# Altium project GameBoard_V1I1.PrjPcb (part 10 of 20)

## Sheet [27] - LEDS, BUTTONS.SchDoc
size A2; DocumentNumber: 26; SheetNumber: 26; SheetTotal: 32
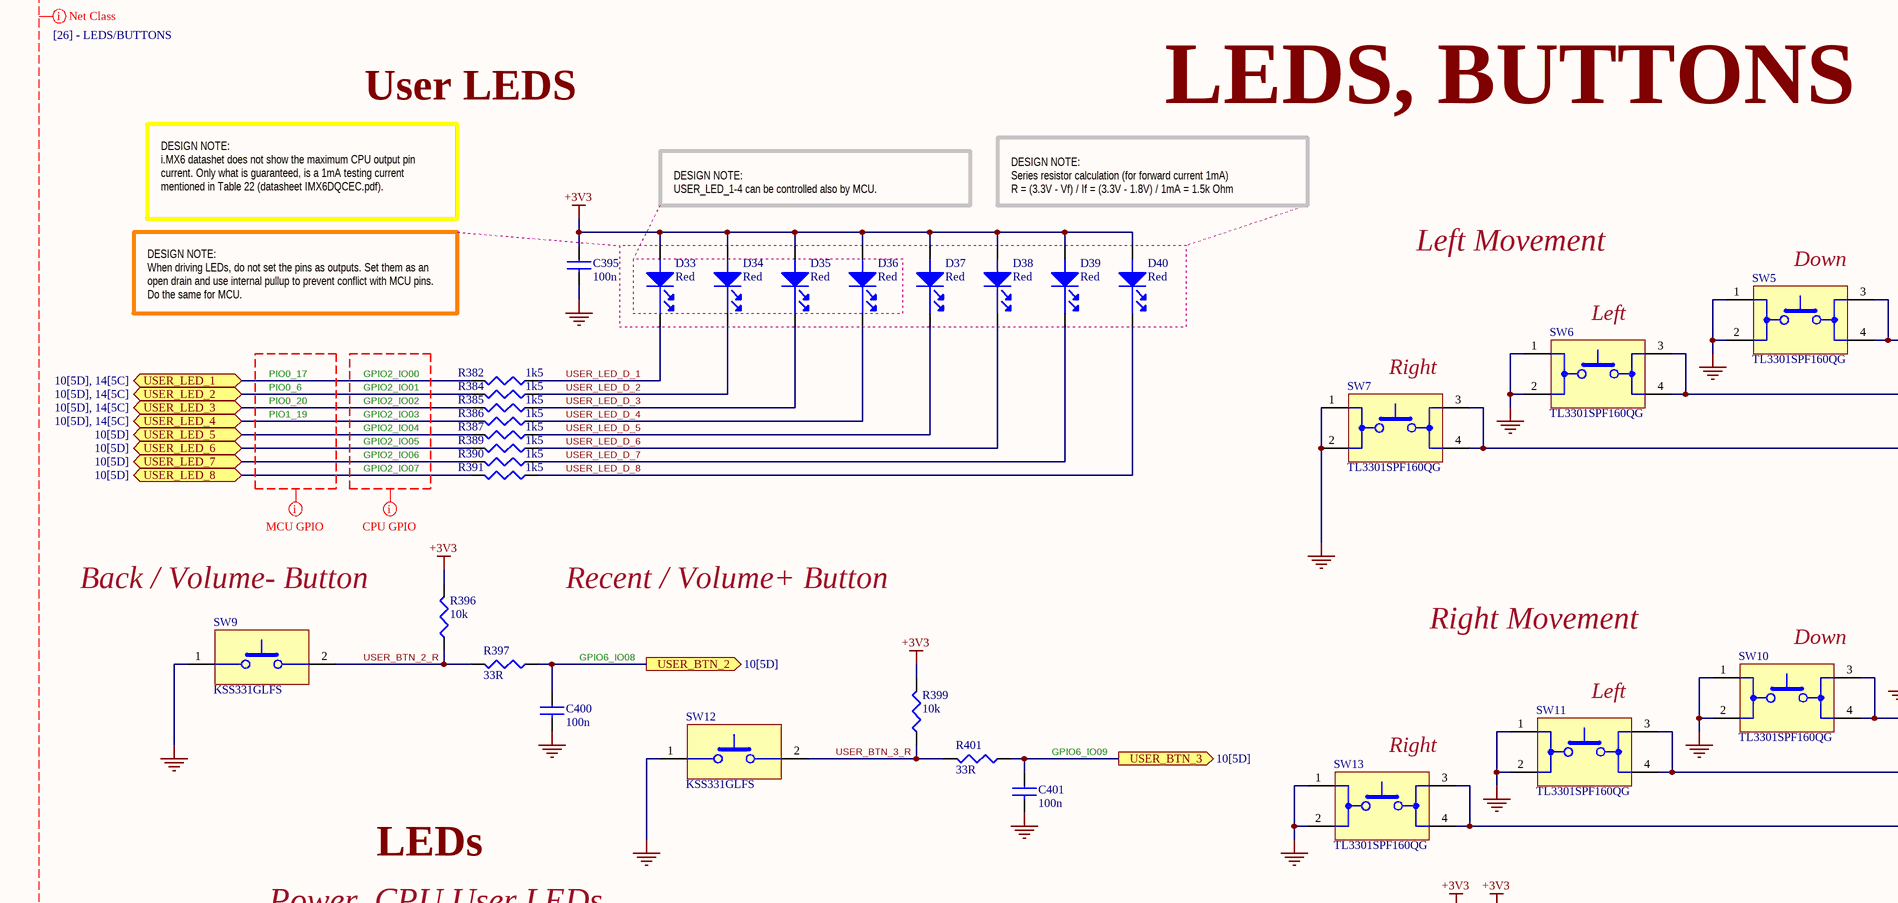
[diagram p58: [27] - LEDS, BUTTONS.SchDoc, top left]
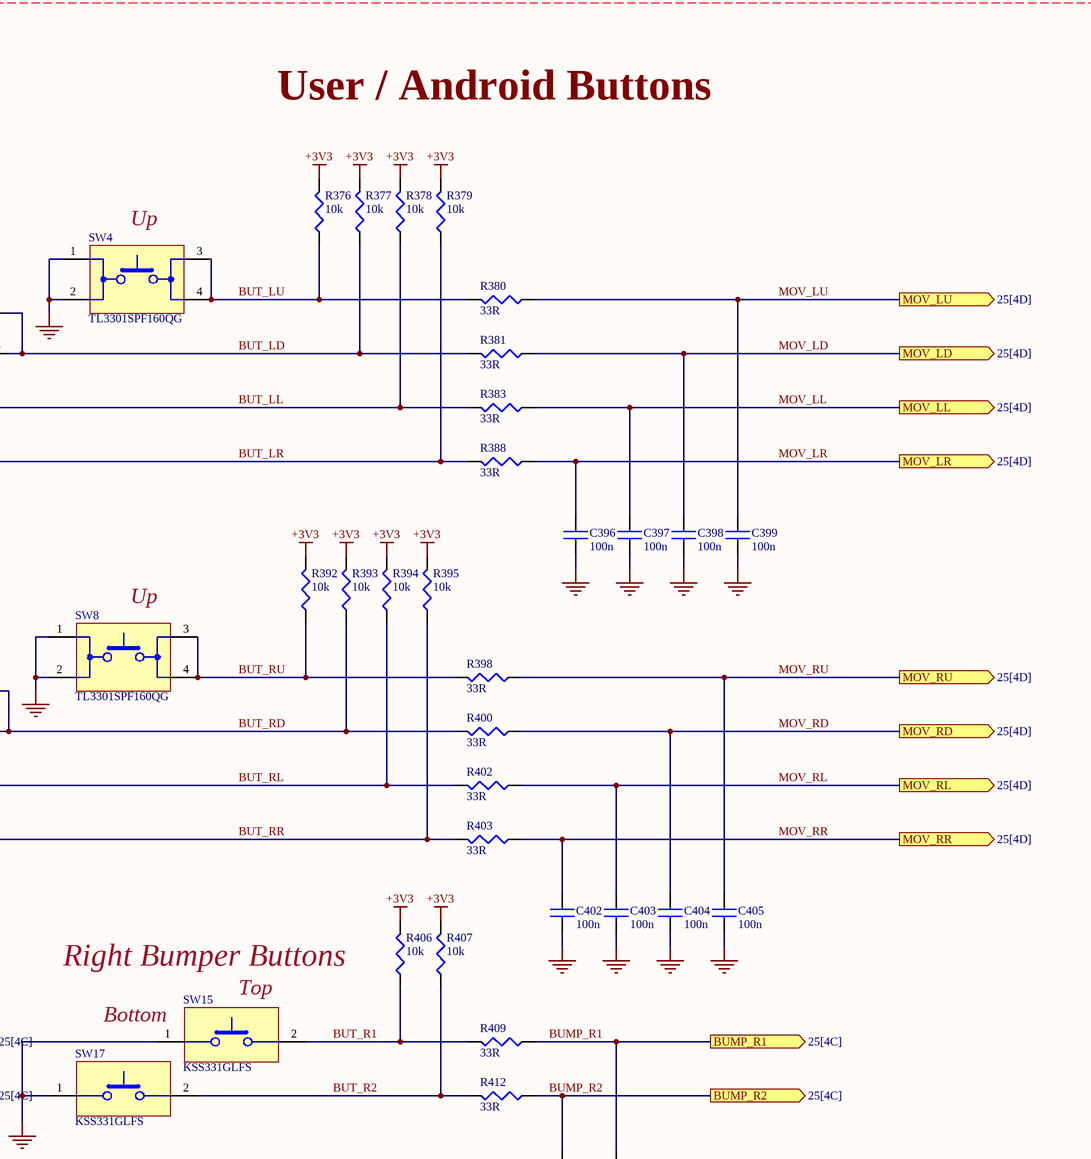
[diagram p59: [27] - LEDS, BUTTONS.SchDoc, top right]
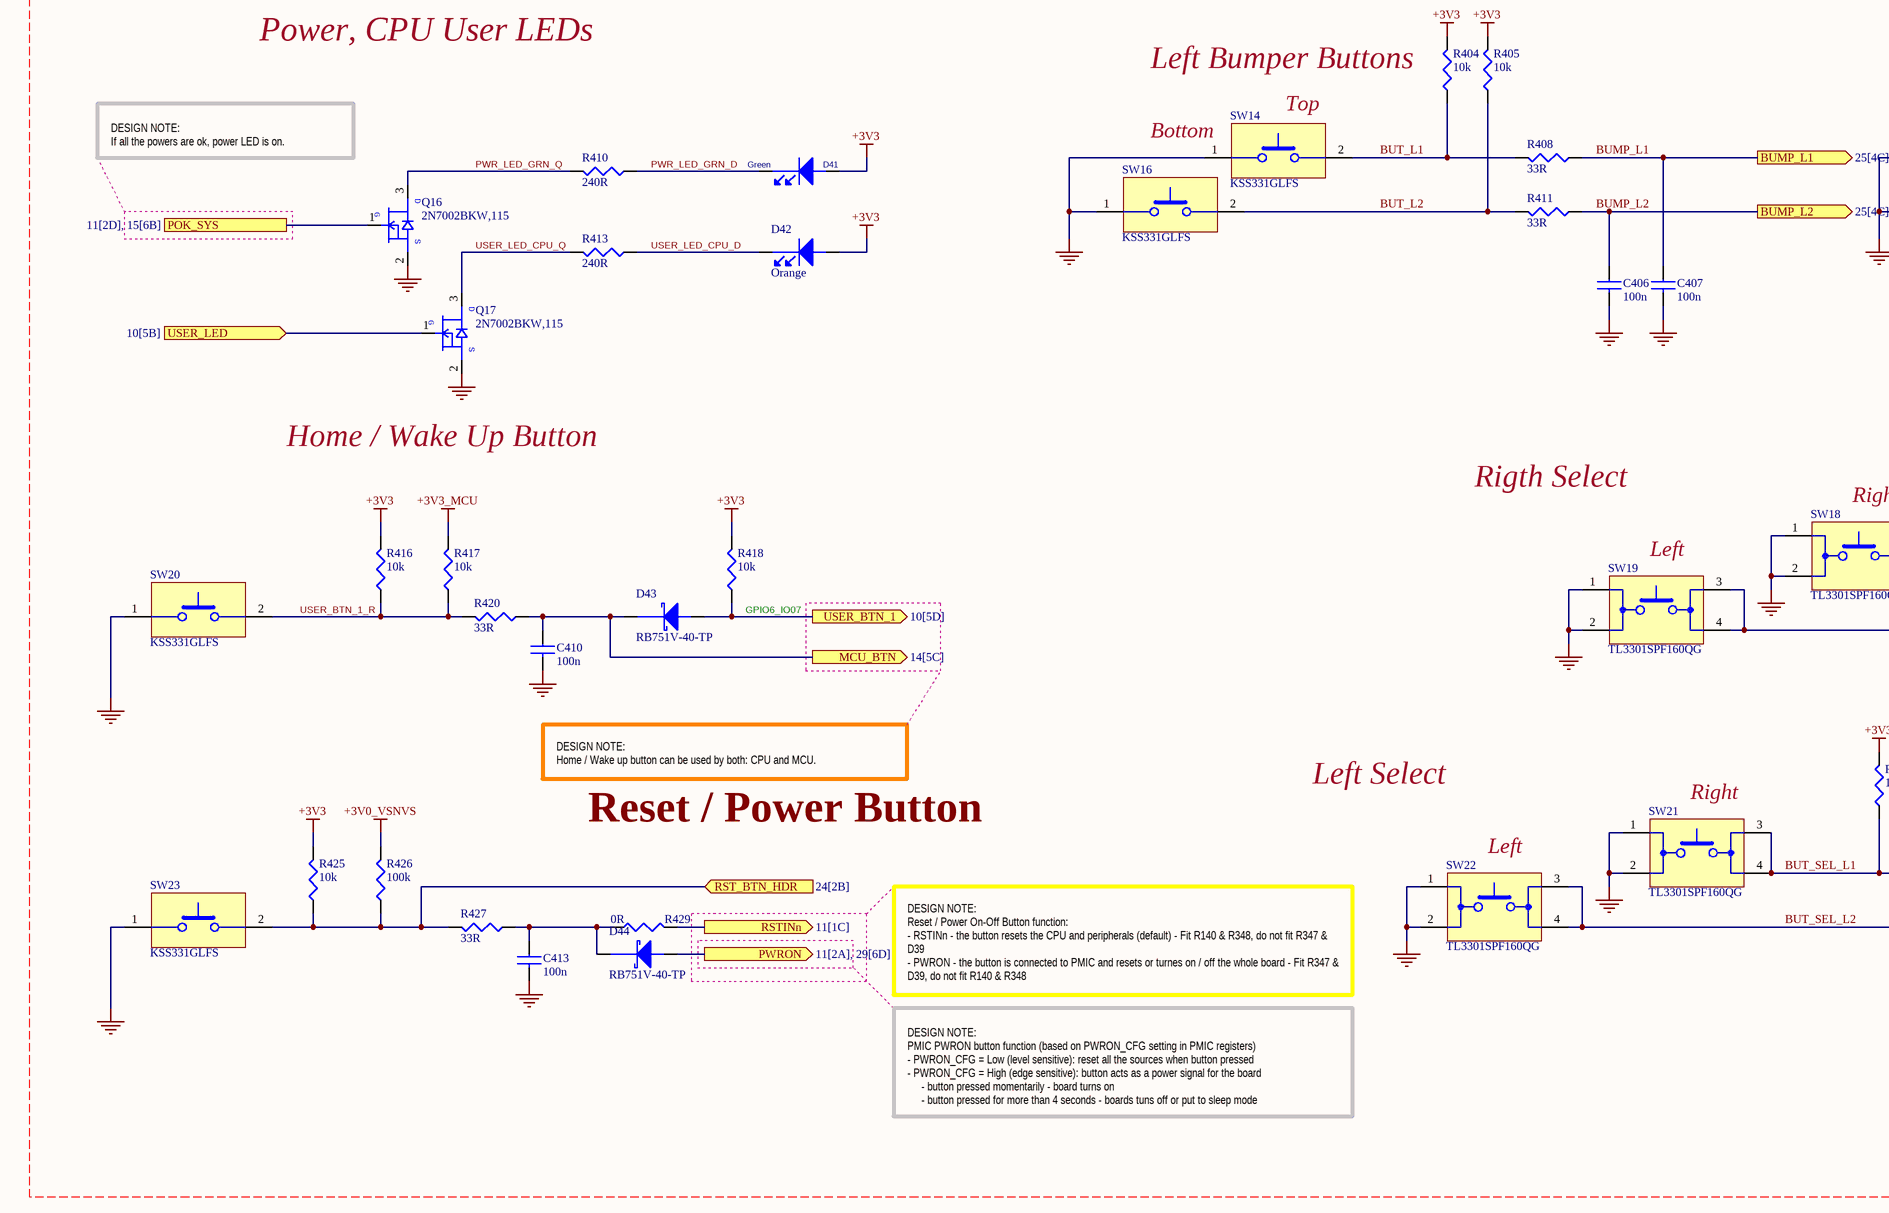
[diagram p60: [27] - LEDS, BUTTONS.SchDoc, bottom left]
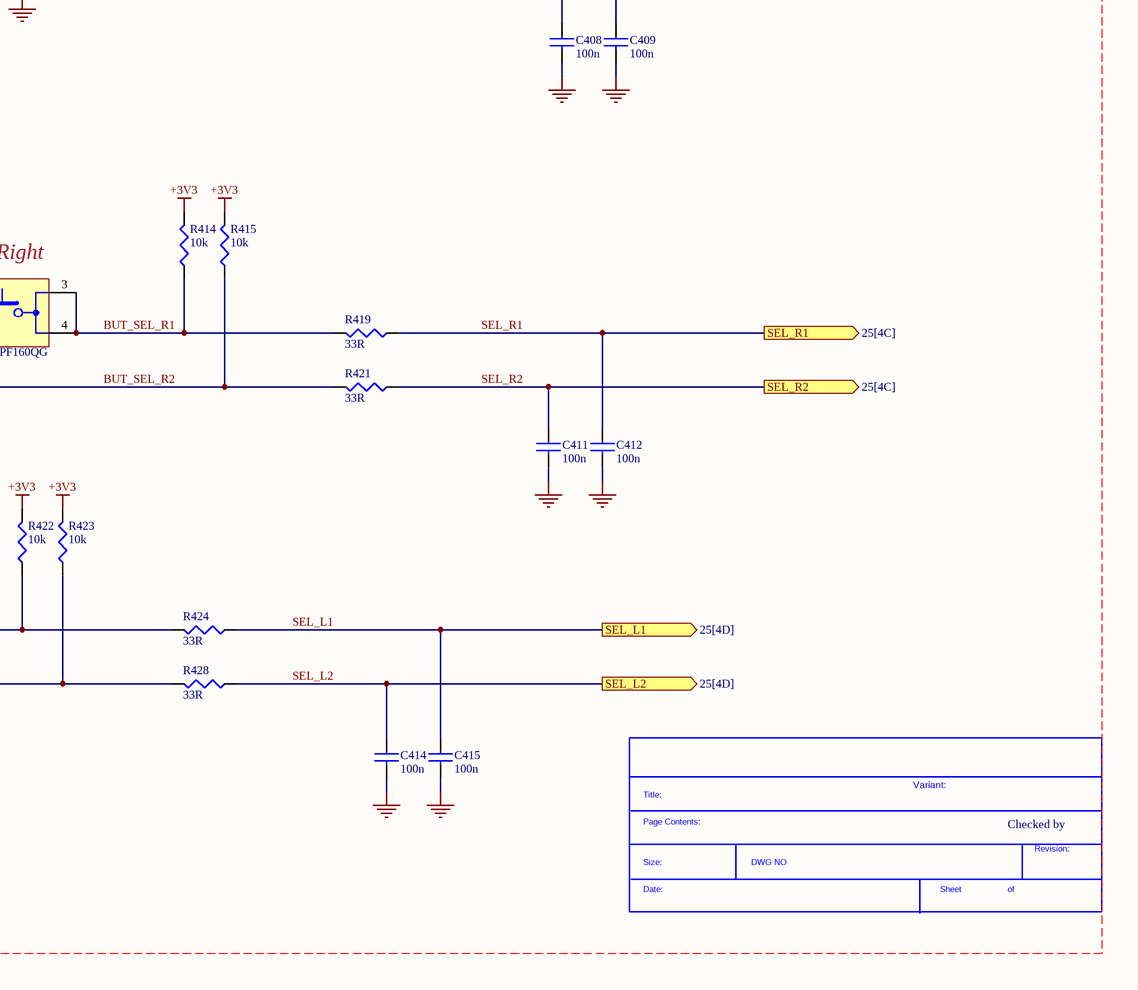
[diagram p61: [27] - LEDS, BUTTONS.SchDoc, bottom right]

### Parts
(Parts that share a designator on the sheet are numbered #1, #2 ... from top to bottom, then left to right.)
*#20  SDTitleBlock  (value not drawn)  (graphical)
C395  100n  [C0402]
C396  100n  [C0402]
C397  100n  [C0402]
C398  100n  [C0402]
C399  100n  [C0402]
C400  100n  [C0402]
C401  100n  [C0402]
C402  100n  [C0402]
C403  100n  [C0402]
C404  100n  [C0402]
C405  100n  [C0402]
C406  100n  [C0402]
C407  100n  [C0402]
C408  100n  [C0402]
C409  100n  [C0402]
C410  100n  [C0402]
C411  100n  [C0402]
C412  100n  [C0402]
C413  100n  [C0402]
C414  100n  [C0402]
C415  100n  [C0402]
D33  Red  [LED_0603]
D34  Red  [LED_0603]
D35  Red  [LED_0603]
D36  Red  [LED_0603]
D37  Red  [LED_0603]
D38  Red  [LED_0603]
D39  Red  [LED_0603]
D40  Red  [LED_0603]
D41  Green  [LED_0603]
D42  Orange  [LED_0603]
D43  RB751V-40-TP  [SOD323]
D44  RB751V-40-TP  [SOD323]
Q16  2N7002BKW,115  [SC70_SOT323]
Q17  2N7002BKW,115  [SC70_SOT323]
R376  10k  [R0402]
R377  10k  [R0402]
R378  10k  [R0402]
R379  10k  [R0402]
R380  33R  [R0402]
R381  33R  [R0402]
R382  1k5  [R0402]
R383  33R  [R0402]
R384  1k5  [R0402]
R385  1k5  [R0402]
R386  1k5  [R0402]
R387  1k5  [R0402]
R388  33R  [R0402]
R389  1k5  [R0402]
R390  1k5  [R0402]
R391  1k5  [R0402]
R392  10k  [R0402]
R393  10k  [R0402]
R394  10k  [R0402]
R395  10k  [R0402]
R396  10k  [R0402]
R397  33R  [R0402]
R398  33R  [R0402]
R399  10k  [R0402]
R400  33R  [R0402]
R401  33R  [R0402]
R402  33R  [R0402]
R403  33R  [R0402]
R404  10k  [R0402]
R405  10k  [R0402]
R406  10k  [R0402]
R407  10k  [R0402]
R408  33R  [R0402]
R409  33R  [R0402]
R410  240R  [R0402]
R411  33R  [R0402]
R412  33R  [R0402]
R413  240R  [R0402]
R414  10k  [R0402]
R415  10k  [R0402]
R416  10k  [R0402]
R417  10k  [R0402]
R418  10k  [R0402]
R419  33R  [R0402]
R420  33R  [R0402]
R421  33R  [R0402]
R422  10k  [R0402]
R423  10k  [R0402]
R424  33R  [R0402]
R425  10k  [R0402]
R426  100k  [R0402]
R427  33R  [R0402]
R428  33R  [R0402]
R429  0R  [R0402]
SW4  TL3301SPF160QG  [TACT_SMD_PLUNGER]
SW5  TL3301SPF160QG  [TACT_SMD_PLUNGER]
SW6  TL3301SPF160QG  [TACT_SMD_PLUNGER]
SW7  TL3301SPF160QG  [TACT_SMD_PLUNGER]
SW8  TL3301SPF160QG  [TACT_SMD_PLUNGER]
SW9  KSS331GLFS  [TACT_SMD_RA]
SW10  TL3301SPF160QG  [TACT_SMD_PLUNGER]
SW11  TL3301SPF160QG  [TACT_SMD_PLUNGER]
SW12  KSS331GLFS  [TACT_SMD_RA]
SW13  TL3301SPF160QG  [TACT_SMD_PLUNGER]
SW14  KSS331GLFS  [TACT_SMD_RA]
SW15  KSS331GLFS  [TACT_SMD_RA]
SW16  KSS331GLFS  [TACT_SMD_RA]
SW17  KSS331GLFS  [TACT_SMD_RA]
SW18  TL3301SPF160QG  [TACT_SMD_PLUNGER]
SW19  TL3301SPF160QG  [TACT_SMD_PLUNGER]
SW20  KSS331GLFS  [TACT_SMD_RA]
SW21  TL3301SPF160QG  [TACT_SMD_PLUNGER]
SW22  TL3301SPF160QG  [TACT_SMD_PLUNGER]
SW23  KSS331GLFS  [TACT_SMD_RA]

### Ports
BUMP_L1 (out, see 25[4C]), BUMP_L2 (out, see 25[4C]), BUMP_R1 (out, see 25[4C]), BUMP_R2 (out, see 25[4C]), MCU_BTN (out, see 14[5C]), MOV_LD (out, see 25[4D]), MOV_LL (out, see 25[4D]), MOV_LR (out, see 25[4D]), MOV_LU (out, see 25[4D]), MOV_RD (out, see 25[4D]), MOV_RL (out, see 25[4D]), MOV_RR (out, see 25[4D]), MOV_RU (out, see 25[4D]), POK_SYS (see 11[2D], 15[6B]), PWRON (out, see 11[2A], 29[6D]), RST_BTN_HDR (in, see 24[2B]), RSTINn (out, see 11[1C]), SEL_L1 (out, see 25[4D]), SEL_L2 (out, see 25[4D]), SEL_R1 (out, see 25[4C]), SEL_R2 (out, see 25[4C]), USER_BTN_1 (out, see 10[5D]), USER_BTN_2 (out, see 10[5D]), USER_BTN_3 (out, see 10[5D]), USER_LED (in, see 10[5B]), USER_LED_1 (bidir, see 10[5D], 14[5C]), USER_LED_2 (bidir, see 10[5D], 14[5C]), USER_LED_3 (bidir, see 10[5D], 14[5C]), USER_LED_4 (bidir, see 10[5D], 14[5C]), USER_LED_5 (bidir, see 10[5D]), USER_LED_6 (bidir, see 10[5D]), USER_LED_7 (bidir, see 10[5D]), USER_LED_8 (bidir, see 10[5D])

### Nets
+3V0_VSNVS: R426.2
+3V3: C395.1 D33.2(ANODE) D34.2(ANODE) D35.2(ANODE) D36.2(ANODE) D37.2(ANODE) D38.2(ANODE) D39.2(ANODE) D40.2(ANODE) D41.2(ANODE) D42.2(ANODE) R376.2 R377.2 R378.2 R379.2 R392.2 R393.2 R394.2 R395.2 R396.2 R399.2 R404.2 R405.2 R406.2 R407.2 R414.2 R415.2 R416.2 R418.2 R422.2 R423.2 R425.2
+3V3_MCU: R417.2
GND: C395.2 C396.2 C397.2 C398.2 C399.2 C400.2 C401.2 C402.2 C403.2 C404.2 C405.2 C406.2 C407.2 C408.2 C409.2 C410.2 C411.2 C412.2 C413.2 C414.2 C415.2 Q16.2(SOURCE) Q17.2(SOURCE) SW4.1 SW4.2 SW5.1 SW5.2 SW6.1 SW6.2 SW7.1 SW7.2 SW8.1 SW8.2 SW9.1 SW10.1 SW10.2 SW11.1 SW11.2 SW12.1 SW13.1 SW13.2 SW14.1 SW15.1 SW16.1 SW17.1 SW18.1 SW18.2 SW19.1 SW19.2 SW20.1 SW21.1 SW21.2 SW22.1 SW22.2 SW23.1
BUMP_L1: C407.1 R408.1 ; port BUMP_L1
BUMP_L2: C406.1 R411.1 ; port BUMP_L2
BUMP_R1: C409.1 R409.1 ; port BUMP_R1
BUMP_R2: C408.1 R412.1 ; port BUMP_R2
BUT_L1: R404.1 R408.2 SW14.2
BUT_L2: R405.1 R411.2 SW16.2
BUT_LD: R377.1 R381.2 SW5.3(MECH1) SW5.4(MECH2)
BUT_LL: R378.1 R383.2 SW6.3(MECH1) SW6.4(MECH2)
BUT_LR: R379.1 R388.2 SW7.3(MECH1) SW7.4(MECH2)
BUT_LU: R376.1 R380.2 SW4.3(MECH1) SW4.4(MECH2)
BUT_R1: R406.1 R409.2 SW15.2
BUT_R2: R407.1 R412.2 SW17.2
BUT_RD: R393.1 R400.2 SW10.3(MECH1) SW10.4(MECH2)
BUT_RL: R394.1 R402.2 SW11.3(MECH1) SW11.4(MECH2)
BUT_RR: R395.1 R403.2 SW13.3(MECH1) SW13.4(MECH2)
BUT_RU: R392.1 R398.2 SW8.3(MECH1) SW8.4(MECH2)
BUT_SEL_L1: R422.1 R424.2 SW21.3(MECH1) SW21.4(MECH2)
BUT_SEL_L2: R423.1 R428.2 SW22.3(MECH1) SW22.4(MECH2)
BUT_SEL_R1: R414.1 R419.2 SW18.3(MECH1) SW18.4(MECH2)
BUT_SEL_R2: R415.1 R421.2 SW19.3(MECH1) SW19.4(MECH2)
MCU_BTN: C410.1 D43.1(cathode) R420.1 ; port MCU_BTN
MOV_LD: C398.1 R381.1 ; port MOV_LD
MOV_LL: C397.1 R383.1 ; port MOV_LL
MOV_LR: C396.1 R388.1 ; port MOV_LR
MOV_LU: C399.1 R380.1 ; port MOV_LU
MOV_RD: C404.1 R400.1 ; port MOV_RD
MOV_RL: C403.1 R402.1 ; port MOV_RL
MOV_RR: C402.1 R403.1 ; port MOV_RR
MOV_RU: C405.1 R398.1 ; port MOV_RU
POK_SYS: Q16.1(GATE) ; port POK_SYS
PWR_LED_GRN_D: D41.1(cathode) R410.1
PWR_LED_GRN_Q: Q16.3(DRAIN) R410.2
PWRON: D44.2(ANODE) ; port PWRON
RST_BTN_HDR: R425.1 R426.1 R427.2 SW23.2 ; port RST_BTN_HDR
RSTINn: R429.2 ; port RSTINn
SEL_L1: C415.1 R424.1 ; port SEL_L1
SEL_L2: C414.1 R428.1 ; port SEL_L2
SEL_R1: C412.1 R419.1 ; port SEL_R1
SEL_R2: C411.1 R421.1 ; port SEL_R2
USER_BTN_1: D43.2(ANODE) R418.1 ; port USER_BTN_1
USER_BTN_1_R: R416.1 R417.1 R420.2 SW20.2
USER_BTN_2: C400.1 R397.1 ; port USER_BTN_2
USER_BTN_2_R: R396.1 R397.2 SW9.2
USER_BTN_3: C401.1 R401.1 ; port USER_BTN_3
USER_BTN_3_R: R399.1 R401.2 SW12.2
USER_LED: Q17.1(GATE) ; port USER_LED
USER_LED_1: R382.2 ; port USER_LED_1
USER_LED_2: R384.2 ; port USER_LED_2
USER_LED_3: R385.2 ; port USER_LED_3
USER_LED_4: R386.2 ; port USER_LED_4
USER_LED_5: R387.2 ; port USER_LED_5
USER_LED_6: R389.2 ; port USER_LED_6
USER_LED_7: R390.2 ; port USER_LED_7
USER_LED_8: R391.2 ; port USER_LED_8
USER_LED_CPU_D: D42.1(cathode) R413.1
USER_LED_CPU_Q: Q17.3(DRAIN) R413.2
USER_LED_D_1: D33.1(cathode) R382.1
USER_LED_D_2: D34.1(cathode) R384.1
USER_LED_D_3: D35.1(cathode) R385.1
USER_LED_D_4: D36.1(cathode) R386.1
USER_LED_D_5: D37.1(cathode) R387.1
USER_LED_D_6: D38.1(cathode) R389.1
USER_LED_D_7: D39.1(cathode) R390.1
USER_LED_D_8: D40.1(cathode) R391.1
NetC413_1: C413.1 D44.1(cathode) R427.1 R429.1

### Layout directives
mark named CPU GPIO: (no net found under the mark)
mark named MCU GPIO: (no net found under the mark)
net class [26] - LEDS/BUTTONS: +3V0_VSNVS, +3V3, +3V3_MCU, BUMP_L1, BUMP_L2, BUMP_R1, BUMP_R2, BUT_L1, BUT_L2, BUT_LD, BUT_LL, BUT_LR, BUT_LU, BUT_R1, BUT_R2, BUT_RD, BUT_RL, BUT_RR, BUT_RU, BUT_SEL_L1, BUT_SEL_L2, BUT_SEL_R1, BUT_SEL_R2, GND, MOV_LD, MOV_LL, MOV_LR, MOV_LU, MOV_RD, MOV_RL, MOV_RR, MOV_RU, PWR_LED_GRN_D, PWR_LED_GRN_Q, SEL_L1, SEL_L2, SEL_R1, SEL_R2, USER_BTN_1_R, USER_BTN_2_R, USER_BTN_3_R, USER_LED_CPU_D, USER_LED_CPU_Q, USER_LED_D_1, USER_LED_D_2, USER_LED_D_3, USER_LED_D_4, USER_LED_D_5, USER_LED_D_6, USER_LED_D_7, USER_LED_D_8

### Notes on the sheet
- User LEDS
- LEDS, BUTTONS
- User / Android Buttons
- DESIGN NOTE:
  i.MX6 datashet does not show the maximum CPU output pin current. Only what is guaranteed, is a 1mA testing current mentioned in Table 22 (datasheet IMX6DQCEC.pdf).
- DESIGN NOTE:
  USER_LED_1-4 can be controlled also by MCU.
- DESIGN NOTE:
  Series resistor calculation (for forward current 1mA)
  R = (3.3V - Vf) / If = (3.3V - 1.8V) / 1mA = 1.5k Ohm
- Left Movement
- (near SW5) Down
- (near SW4) Up
- DESIGN NOTE:
  When driving LEDs, do not set the pins as outputs. Set them as an open drain and use internal pullup to prevent conflict with MCU pins. Do the same for MCU.
- (near SW6) Left
- PIO0_6
- PIO0_20
- PIO0_17
- GPIO2_IO00
- GPIO2_IO01
- GPIO2_IO02
- (near SW7) Right
- PIO1_19
- GPIO2_IO03
- GPIO2_IO04
- GPIO2_IO05
- GPIO2_IO06
- GPIO2_IO07
- (near R396) Back / Volume- Button
- Recent / Volume+ Button
- (near SW8) Up
- GPIO6_IO08
- Right Movement
- (near SW10) Down
- (near SW11) Left
- GPIO6_IO09
- (near SW13) Right
- LEDs
- Power, CPU User LEDs
- (near R404) Left Bumper Buttons
- (near SW14) Bottom
- (near SW14) Top
- (near R406) Right Bumper Buttons
- (near SW15) Bottom
- (near SW15) Top
- DESIGN NOTE:
  If all the powers are ok, power LED is on.
- Home / Wake Up Button
- Rigth Select
- (near SW18) Right
- (near R418) GPIO6_IO07
- (near SW19) Left
- DESIGN NOTE:
  Home / Wake up button can be used by both: CPU and MCU.
- Left Select
- (near SW21) Right
- Reset / Power Button
- (near SW22) Left
- DESIGN NOTE:
  Reset / Power On-Off Button function:
  - RSTINn - the button resets the CPU and peripherals (default) - Fit R140 & R348, do not fit R347 & D39
  - PWRON - the button is connected to PMIC and resets or turnes on / off the whole board - Fit R347 & D39, do not fit R140 & R348
- Variant:
- Checked by
- DESIGN NOTE:
  PMIC PWRON button function (based on PWRON_CFG setting in PMIC registers)
  - PWRON_CFG = Low (level sensitive): reset all the sources when button pressed
  - PWRON_CFG = High (edge sensitive): button acts as a power signal for the board
  - button pressed momentarily - board turns on
  - button pressed for more than 4 seconds - boards tuns off or put to sleep mode
- (in symbol 2N7002BKW,115) D; G; S
- (in symbol SDTitleBlock) Title:; Page Contents:; Revision:; Size:; DWG NO; Date:; Sheet; of

### Library data of the parts
C395-C415 = C1005X5R1H104K: as C241 on sheet [19] - USB; Category: Capacitors; Supplier Part Number: 445-5942-1-ND; Manufacturer Part Number: C1005X5R1H104K; Operating Temperature: -55°C ~ 85°C; Package / Case: 0402 (1005 Metric); Price 1k [$]: 0.02340; .Checked SCH: used; Voltage - Rated: 50V; Supplier: Digikey; Supplier 1: Digi-Key; Supplier Part Number 1: 445-5942-1-ND; RoHS: RoHS Compliant; Stock 1: 106926; Pricing 1: 1=0.27, 10=0.18, 100=0.072, 250=0.05176, 500=0.0369, 1000=0.027 (USD); Tolerance: ±10%; Temperature Coefficient: X5R; Mounting Type: Surface Mount, MLCC; Applications: General Purpose; Ratings: -; Size / Dimension: 0.039" L x 0.020" W (1.00mm x 0.50mm); Height - Seated (Max): -; Thickness (Max): 0.022" (0.55mm); Lead Spacing: -; Features: -; Packaging: Cut Tape (CT); Lead Style: -; ComponentLink1URL: http://www.tdk.co.jp/tefe02/e412_c.pdf; ComponentLink1Description: http://www.tdk.co.jp/tefe02/e412_c.pdf; Supplier 2: Digi-Key; Supplier Part Number 2: 311-1697-6-ND
D33-D40 = LS L29K-H1J2-1-Z: LED SMARTLED RED 630NM 0603 SMD; Manufacturer: OSRAM Opto Semiconductors Inc; Millicandela Rating: 4.95mcd; Voltage - Forward (Vf) Typ: 1.8V; Current - Test: 2mA; Wavelength - Peak: 643nm; Viewing Angle: 160°; Lens Type: Diffused; Lens Style/Size: Rectangle with Flat Top, 1.3mm x 0.8mm; Luminous Flux @ Current - Test: 20 mlm; .Checked PCB: used; Supplier 1: Digi-Key; Supplier Part Number 1: 475-1195-1-ND; Manufacturer Part Number: LS L29K-H1J2-1-Z; RoHS: RoHS Compliant; Category: Optoelectronics; Stock 1: 71670; Pricing 1: 1=0.16, 10=0.137, 100=0.1093, 250=0.09564, 500=0.08744 (USD); Color: Red; Wavelength - Dominant: 630nm; Package / Case: 0603 (1608 Metric); Size / Dimension: 1.70mm L x 0.80mm W; Height: 0.65mm; Mounting Type: Surface Mount; Packaging: Cut Tape (CT); ComponentLink1URL: http://catalog.osram-os.com/catalogue/catalogue.do;jsessionid=DB7CFDBAC5AF1E216E45F622E867085A?act=downloadFile&favOid=020000010003f9de000100b6; ComponentLink1Description: http://catalog.osram-os.com/catalogue/catalogue.do;jsessionid=DB7CFDBAC5AF1E216E45F622E867085A?act=downloadFile&favOid=020000010003f9de000100b6; .Checked SCH: used
D41 = LG L29K-G2J1-24-Z: LED SMARTLED GREEN 570NM 0603; Manufacturer: OSRAM Opto Semiconductors Inc; .Checked PCB: used; Current - Test: 2mA; Voltage - Forward (Vf) Typ: 1.7V; Luminous Flux @ Current - Test: 12 mlm; Millicandela Rating: 3.92mcd; Wavelength - Peak: 572nm; Lens Type: Diffused; Lens Style/Size: Rectangle with Flat Top, 1.3mm x 0.8mm; Viewing Angle: 160°; Regulator Topology: Positive Fixed; Voltage - Output: 2.5V; Voltage - Input: 2.6 V ~ 6 V; Voltage - Dropout (Typical): 0.16V @ 500mA; Number of Regulators: 1; Current - Output: 500mA; Current - Limit (Min): 600mA; .Checked SCH: used; Category: Optoelectronics; Family: LEDs - <75mA, Discre; Manufacturer Part Number: LG L29K-G2J1-24-Z; Price 1k [$]: 0.08744; Value: Green; Color: Green; Package / Case: 0603 (1608 Metric); Supplier Part Number: 475-2709-1-ND; Supplier: Digikey; Supplier 1: Digi-Key; Supplier Part Number 1: 475-2709-1-ND; RoHS: RoHS Compliant; Stock 1: 30318; Pricing 1: 1=0.16, 10=0.137, 100=0.1093, 250=0.09564, 500=0.08744 (USD); Wavelength - Dominant: 570nm; Size / Dimension: 1.70mm L x 0.80mm W; Height: 0.65mm; Mounting Type: Surface Mount; Packaging: Cut Tape (CT); ComponentLink1URL: http://catalog.osram-os.com/catalogue/catalogue.do;jsessionid=32CB61882C089EDD4B6D0A54E7E1F117?act=downloadFile&favOid=020000020000138e000100b6; ComponentLink1Description: http://catalog.osram-os.com/catalogue/catalogue.do;jsessionid=32CB61882C089EDD4B6D0A54E7E1F117?act=downloadFile&favOid=020000020000138e000100b6; Operating Temperature: -40°C ~ 125°C; Supplier Device Package: 6-TMLF® (1.6x1.6); ComponentLink2URL: http://www.micrel.com/_PDF/mic5353.pdf; ComponentLink2Description: http://www.micrel.com/_PDF/mic5353.pdf
D42 = LO L29K-H2K1-24-Z: as D11 on sheet [19] - USB; Supplier 1: Digi-Key; Supplier Part Number 1: 475-2740-1-ND; Manufacturer Part Number: LO L29K-H2K1-24-Z; RoHS: RoHS Compliant; Category: Optoelectronics; Stock 1: 15900; Pricing 1: 1=0.17, 10=0.141, 100=0.1127, 250=0.0986, 500=0.09016 (USD); Color: Orange; Wavelength - Dominant: 606nm; Package / Case: 0603 (1608 Metric); Size / Dimension: 1.70mm L x 0.80mm W; Height: 0.65mm; Mounting Type: Surface Mount; Packaging: Cut Tape (CT); ComponentLink1URL: http://catalog.osram-os.com/catalogue/catalogue.do;jsessionid=302CF83AF637AE24E40AEB0ADA267EDD?act=downloadFile&favOid=020000010003f9de000100b6; ComponentLink1Description: http://catalog.osram-os.com/catalogue/catalogue.do;jsessionid=302CF83AF637AE24E40AEB0ADA267EDD?act=downloadFile&favOid=020000010003f9de000100b6; .Checked SCH: used
D43 D44 = RB751V-40-TP: as D23 on sheet [14] - MCU; Supplier 1: Digi-Key; Supplier Part Number 1: RB751V-40-TPMSCT-ND; Manufacturer Part Number: RB751V-40-TP; RoHS: RoHS Compliant; Category: Discrete Semiconductor Products; Stock 1: 18964; Pricing 1: 1=0.48, 10=0.342, 100=0.2014, 250=0.14252, 500=0.1216, 1000=0.095 (USD); Voltage - DC Reverse (Vr) (Max): 30V; Current - Average Rectified (Io): 30mA; Reverse Recovery Time (trr): -; Mounting Type: Surface Mount; Package / Case: SC-76, SOD-323; Supplier Device Package: SOD-323; Packaging: Cut Tape (CT); ComponentLink1URL: http://www.mccsemi.com/up_pdf/RB751V-40(SOD-323).PDF; ComponentLink1Description: Data Sheet; .Checked SCH: used
Q16 Q17 = 2N7002BKW,115: as Q8 on sheet [14] - MCU; Supplier 1: Digi-Key; Supplier Part Number 1: 1727-4788-1-ND; Manufacturer Part Number: 2N7002BKW,115; RoHS: RoHS Compliant; Category: Discrete Semiconductor Products; Drain to Source Voltage (Vdss): 60V; Current - Continuous Drain (Id) @ 25° C: 310mA; Mounting Type: Surface Mount; Package / Case: SC-70, SOT-323; Supplier Device Package: SC-70; Packaging: Cut Tape (CT); ComponentLink1URL: http://www.nxp.com/documents/data_sheet/2N7002BKW.pdf; ComponentLink1Description: http://www.nxp.com/documents/data_sheet/2N7002BKW.pdf; .Checked SCH: used
R376-R379 R392-R396 R399 R404-R407 R414-R418 R422 R423 R425 = RC0402FR-0710KL: as R173 on sheet [19] - USB; Category: Resistors; Supplier Part Number: 311-10.0KLRCT-ND; Manufacturer Part Number: RC0402FR-0710KL; Package / Case: 0402 (1005 Metric); Price 1k [$]: 0.01421; Resistance (Ohms): 10K; Tolerance: ±1%; Value: 10k; .Checked SCH: used; Supplier: Digikey; Supplier 1: Digi-Key; Supplier Part Number 1: 311-10.0KLRCT-ND; RoHS: RoHS Compliant; Stock 1: 2916495; Pricing 1: 10=0.014, 50=0.0104, 100=0.0079, 250=0.00584, 500=0.00432, 1000=0.00288 (USD); Composition: Thick Film; Features: -; Size / Dimension: 0.039" L x 0.020" W (1.00mm x 0.50mm); Height: 0.016" (0.40mm); Number of Terminations: 2; Packaging: Cut Tape (CT); ComponentLink1URL: http://www.yageo.com/documents/recent/PYu-RC0402_51_RoHS_L_6.pdf; ComponentLink1Description: http://www.yageo.com/documents/recent/PYu-RC0402_51_RoHS_L_6.pdf
R380 R381 R383 R388 R397 R398 R400-R403 R408 R409 R411 R412 R419-R421 R424 R427 R428 = RMCF0402FT33R0: as R275 on sheet [14] - MCU; Category: Resistors; Supplier Part Number: RMCF0402FT33R0CT-ND; Manufacturer Part Number: RMCF0402FT33R0; Package / Case: 0402 (1005 Metric); Price 1k [$]: 0.00384; Tolerance: ±1%; Value: 33R; .Checked SCH: used; Supplier: Digikey; Supplier 1: Digi-Key; Supplier Part Number 1: RMCF0402FT33R0CT-ND; RoHS: RoHS Compliant; Stock 1: 26866; Pricing 1: 1=0.04, 10=0.025, 50=0.0138, 100=0.0105, 250=0.0078, 500=0.00576, 1000=0.00384 (USD); Composition: Thick Film; Features: -; Size / Dimension: 0.039" L x 0.020" W (1.00mm x 0.50mm); Height: 0.016" (0.40mm); Number of Terminations: 2; Packaging: Cut Tape (CT); ComponentLink1URL: http://www.seielect.com/Catalog/SEI-RMCF.pdf; ComponentLink1Description: http://www.seielect.com/Catalog/SEI-RMCF.pdf
R382 R384-R387 R389-R391 = RC0402FR-071K5L: as R274 on sheet [14] - MCU; Supplier 1: Digi-Key; Manufacturer Part Number: RC0402FR-071K5L; RoHS: RoHS Compliant; Category: Resistors; Stock 1: 499348; Pricing 1: 1=0.1, 10=0.014, 25=0.0104, 100=0.0063, 250=0.0054, 500=0.00382, 1000=0.0027, 2500=0.00234, 5000=0.00203 (USD); Packaging: Cut Tape (CT); Tolerance: ±1%; Composition: Thick Film; Features: -; Package / Case: 0402 (1005 Metric); Supplier Device Package: 0402; Size / Dimension: 0.039" L x 0.020" W (1.00mm x 0.50mm); Height: 0.016" (0.40mm); Number of Terminations: 2; ComponentLink1URL: http://www.yageo.com/documents/recent/PYu-RC0402_51_RoHS_L_6.pdf; ComponentLink1Description: http://www.yageo.com/documents/recent/PYu-RC0402_51_RoHS_L_6.pdf; Supplier Part Number 1: 311-1.50KLRCT-ND; .Checked SCH: used
R410 R413 = RMCF0402FT240R: as R270 on sheet [14] - MCU; Category: Resistors; Supplier Part Number: RMCF0402FT240RCT-ND; Manufacturer Part Number: RMCF0402FT240R; Package / Case: 0402 (1005 Metric); Price 1k [$]: 0.00384; Tolerance: ±1%; Value: 240R; .Checked SCH: used; Supplier: Digikey; Supplier 1: Digi-Key; Supplier Part Number 1: RMCF0402FT240RCT-ND; RoHS: RoHS Compliant; Stock 1: 39860; Pricing 1: 1=0.04, 10=0.025, 50=0.0138, 100=0.0105, 250=0.0078, 500=0.00576, 1000=0.00384 (USD); Composition: Thick Film; Features: -; Size / Dimension: 0.039" L x 0.020" W (1.00mm x 0.50mm); Height: 0.016" (0.40mm); Number of Terminations: 2; Packaging: Cut Tape (CT); ComponentLink1URL: http://www.seielect.com/Catalog/SEI-RMCF.pdf; ComponentLink1Description: http://www.seielect.com/Catalog/SEI-RMCF.pdf
R426 = RMCF0402FT100K: as R183 on sheet [19] - USB; Category: Resistors; Supplier Part Number: RMCF0402FT100KCT-ND; Manufacturer Part Number: RMCF0402FT100K; Package / Case: 0402 (1005 Metric); Price 1k [$]: 0.00384; Resistance (Ohms): 100K; Tolerance: ±1%; Value: 100k; .Checked SCH: used; Supplier: Digikey; Supplier 1: Digi-Key; Supplier Part Number 1: YAG1343DKR-ND; RoHS: RoHS Compliant; Composition: Thick Film; Features: -; Size / Dimension: 0.039" L x 0.020" W (1.00mm x 0.50mm); Height: 0.016" (0.40mm); Number of Terminations: 2; Packaging: Cut Tape (CT); ComponentLink1URL: http://www.seielect.com/Catalog/SEI-RMCF.pdf; ComponentLink1Description: http://www.seielect.com/Catalog/SEI-RMCF.pdf
R429 = RC0402JR-070RL: as R157-R160 on sheet [19] - USB; Category: Resistors; Supplier Part Number: 311-0.0JRCT-ND; Manufacturer Part Number: RC0402JR-070RL; Package / Case: 0402 (1005 Metric); Price 1k [$]: 0.01389; Value: 0R; .Checked SCH: used; Supplier: Digikey; Supplier 1: Digi-Key; Supplier Part Number 1: 311-0.0JRCT-ND; RoHS: RoHS Compliant; Stock 1: 1106330; Pricing 1: 10=0.012, 50=0.009, 100=0.0069, 250=0.00512, 500=0.0038, 1000=0.00253 (USD); Composition: Thick Film; Features: -; Temperature Coefficient: -; Size / Dimension: 0.039" L x 0.020" W (1.00mm x 0.50mm); Height: 0.016" (0.40mm); Number of Terminations: 2; Packaging: Cut Tape (CT); ComponentLink1URL: http://www.yageo.com/documents/recent/PYu-RC0402_51_RoHS_L_6.pdf; ComponentLink1Description: http://www.yageo.com/documents/recent/PYu-RC0402_51_RoHS_L_6.pdf
SW4-SW8 SW10 SW11 SW13 SW18 SW19 SW21 SW22 = TL3301SPF160QG: SWITCH TACTILE SPST-NO 0.05A 12V; Manufacturer: E-Switch; Mechanical Life: 100000Cycles; Actuator Material: Nylon,Polyamide; Throw Configuration: SPST; Operating Force: 160gf; Current Rating: 50mA; Illumination Type: Non-Illuminated,Illuminated; Switch Travel: 0.25mm; Switch Function: Off-Mom; Contact Resistance: 100mR; Actuator Length: 2.9mm; .Creator: MB; Supplier 1: Digi-Key; Manufacturer Part Number: TL3301SPF160QG; Stock 1: 57828; Pricing 1: 1=0.43, 10=0.419, 25=0.404, 50=0.389, 100=0.374, 250=0.34408 (USD); Mount: Surface Mount; Contact Plating: Silver; Contact Material: Silver; Min Operating Temperature: -20°C; Max Operating Temperature: 70°C; Termination: Gull Wing; Voltage Rating (DC): 12V; Package Quantity: 1; Packaging: Tape and Reel; Max Voltage Rating (DC): 12V; Electrical Life: 100000Cycles; Orientation: Straight; Contact Current Rating: 50mA; Length: 6mm; Width: 6mm; Lead Free: Lead Free; REACH SVHC: No SVHC; ComponentLink1URL: https://datasheet.ciiva.com/2900/tl3301-2900816.pdf; ComponentLink1Description: https://datasheet.ciiva.com/2900/tl3301-2900816.pdf; ComponentLink2URL: https://datasheet.ciiva.com/2900/tl3301-2900817.pdf; ComponentLink2Description: https://datasheet.ciiva.com/2900/tl3301-2900817.pdf; ComponentLink3URL: https://datasheet.ciiva.com/2900/tl3301-2900818.pdf; ComponentLink3Description: https://datasheet.ciiva.com/2900/tl3301-2900818.pdf; ComponentLink4URL: https://datasheet.ciiva.com/16156/j100793-16156342.pdf; ComponentLink4Description: https://datasheet.ciiva.com/16156/j100793-16156342.pdf; ComponentLink5URL: https://datasheet.ciiva.com/16204/tl3301-16204902.pdf; ComponentLink5Description: https://datasheet.ciiva.com/16204/tl3301-16204902.pdf; ComponentLink6URL: https://datasheet.ciiva.com/7637/tl3301-7637662.pdf; ComponentLink6Description: https://datasheet.ciiva.com/7637/tl3301-7637662.pdf; Supplier Part Number 1: EG1869DKR-ND; .Checked SCH: *; .Checked PCB: *
SW9 SW12 SW14-SW17 SW20 SW23 = KSS331GLFS: SWITCH TACTILE SPST-NO 0.05A 50V; Manufacturer: ITT C&K; Mechanical Life: 100000Cycles; Operating Force: 2.5N; Throw Configuration: SPST; Max Current Rating: 50mA; Max Voltage Rating (DC): 32V; Power Rating: 1W; Illumination Type: Non-Illuminated,Illuminated; Switch Travel: 0.3mm; Switch Function: Off-Mom; Contact Resistance: 100mR; Insulation Resistance: 1GR; Actuator Length: 0.8mm; IP Rating: IP40; .Creator: MB; Supplier 1: Digi-Key; Manufacturer Part Number: KSS331GLFS; Stock 1: 32703; Pricing 1: 1=0.75, 10=0.724, 25=0.6828, 50=0.6008, 100=0.5461, 250=0.51884, 500=0.50516, 1000=0.39594 (USD); Mount: Surface Mount; Contact Material: Silver; Contact Plating: Silver; Min Operating Temperature: -40°C; Max Operating Temperature: 85°C; Termination: Gull Wing; Voltage Rating (DC): 32V; Packaging: Tape and Reel; Contact Current Rating: 50mA; Current Rating: 50mA; Package Quantity: 1; Orientation: Right Angle; Length: 4.5mm; Width: 7mm; Depth: 4.4mm; Radiation Hardening: No; REACH SVHC: No SVHC; Lead Free: Lead Free; ComponentLink1URL: https://datasheet.ciiva.com/2900/kss-9aug12-2900416.pdf; ComponentLink1Description: https://datasheet.ciiva.com/2900/kss-9aug12-2900416.pdf; ComponentLink2URL: https://datasheet.ciiva.com/5684/19445-5684464.pdf; ComponentLink2Description: https://datasheet.ciiva.com/5684/19445-5684464.pdf; ComponentLink3URL: https://datasheet.ciiva.com/16210/kss331glfs-16210788.pdf; ComponentLink3Description: https://datasheet.ciiva.com/16210/kss331glfs-16210788.pdf; ComponentLink4URL: https://datasheet.ciiva.com/30466/0900766b8129cd37-30466693.pdf; ComponentLink4Description: https://datasheet.ciiva.com/30466/0900766b8129cd37-30466693.pdf; ComponentLink5URL: https://datasheet.ciiva.com/7987/19445-7987001.pdf; ComponentLink5Description: https://datasheet.ciiva.com/7987/19445-7987001.pdf; ComponentLink6URL: https://datasheet.ciiva.com/7987/19445-7987002.pdf; ComponentLink6Description: https://datasheet.ciiva.com/7987/19445-7987002.pdf; ComponentLink7URL: https://datasheet.ciiva.com/18145/getdatasheetpartid-494910-18145580.pdf; ComponentLink7Description: https://datasheet.ciiva.com/18145/getdatasheetpartid-494910-18145580.pdf; ComponentLink8URL: https://datasheet.ciiva.com/2900/kss-2900414.pdf; ComponentLink8Description: https://datasheet.ciiva.com/2900/kss-2900414.pdf; ComponentLink9URL: https://datasheet.ciiva.com/16695/kss-16695982.pdf; ComponentLink9Description: https://datasheet.ciiva.com/16695/kss-16695982.pdf; ComponentLink10URL: https://datasheet.ciiva.com/2900/kss-2900415.pdf; ComponentLink10Description: https://datasheet.ciiva.com/2900/kss-2900415.pdf; Supplier Part Number 1: 401-1101-6-ND; .Checked SCH: *; .Checked PCB: *